# EAGLE schematic circuit_R2 (EAGLE 7.6.0)
REV: 1
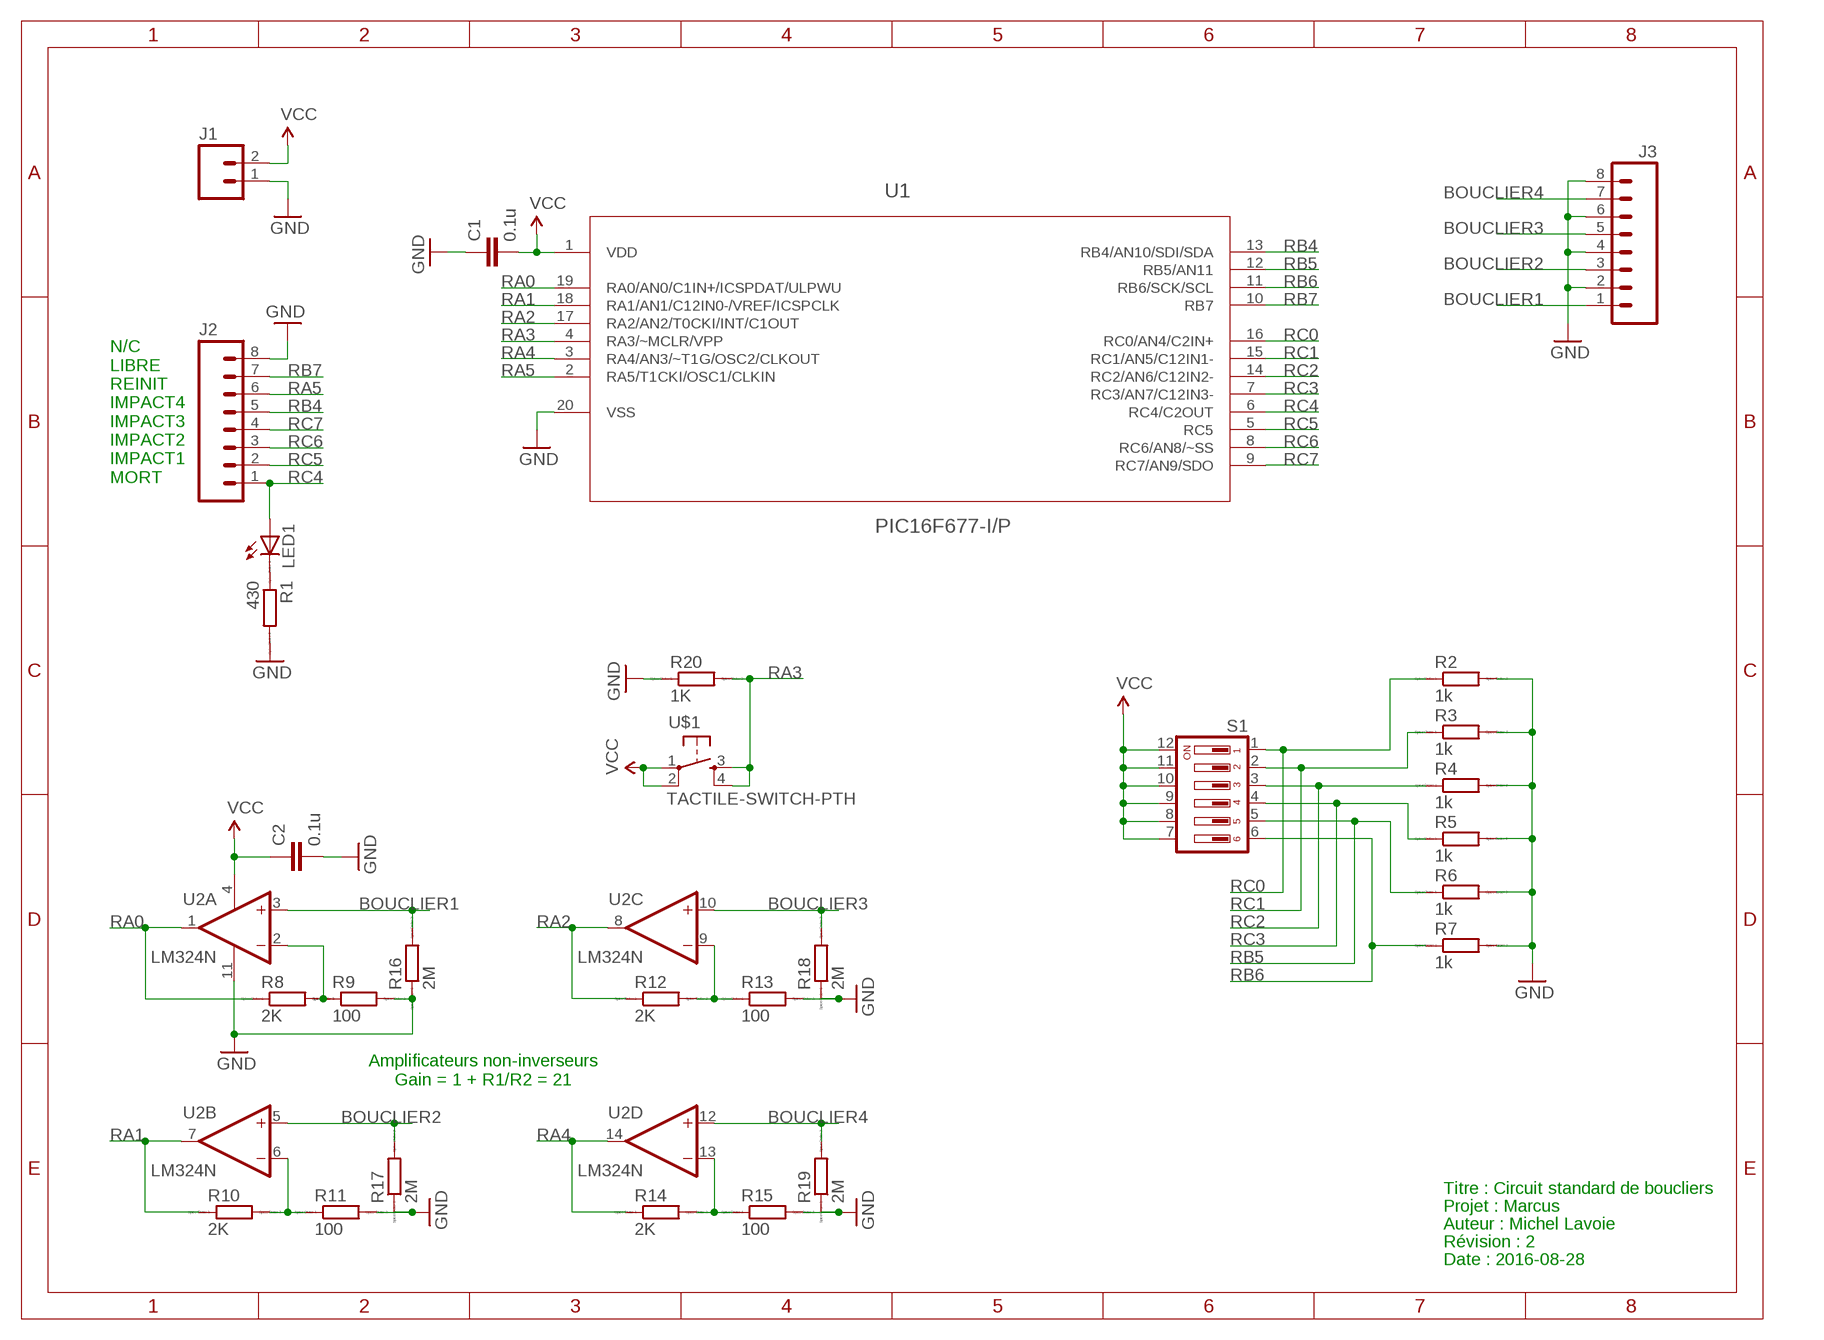
[diagram p0: schematic, sheet 1]

## Parts
C1  0.1u  CAPPTH  [CAP-PTH-SMALL]
C2  0.1u  CAPPTH  [CAP-PTH-SMALL]
J1  M02PTH  [1X02]
J2  M08NO_SILK  [1X08_PIN1_NO_SILK]
J3  M08NO_SILK  [1X08_PIN1_NO_SILK]
LED1  LED3MM  [LED3MM]
R1  430  R0207/10  [0207/10]
R2  1k  R0207/10  [0207/10]
R3  1k  R0207/10  [0207/10]
R4  1k  R0207/10  [0207/10]
R5  1k  R0207/10  [0207/10]
R6  1k  R0207/10  [0207/10]
R7  1k  R0207/10  [0207/10]
R8  2K  R0207/10  [0207/10]
R9  100  R0207/10  [0207/10]
R10  2K  R0207/10  [0207/10]
R11  100  R0207/10  [0207/10]
R12  2K  R0207/10  [0207/10]
R13  100  R0207/10  [0207/10]
R14  2K  R0207/10  [0207/10]
R15  100  R0207/10  [0207/10]
R16  2M  R0207/10  [0207/10]
R17  2M  R0207/10  [0207/10]
R18  2M  R0207/10  [0207/10]
R19  2M  R0207/10  [0207/10]
R20  1K  R0207/10  [0207/10]
S1  DIP06YL  [DIP06YL]
U1  PIC16F677-I/P  [DIP254P762X533-20]
U2  LM324N  [DIL14]
U$1  TACTILE-SWITCH-PTH  [TAC-SWITCH-PTH]

## Nets
5V: C1.2 C2.1 J1.2 S1.7 S1.8 S1.9 S1.10 S1.11 S1.12 U1.1(VDD) U2.4(P:V+) U$1.1 U$1.2 ; supply symbol labelled VCC
BOUCLIER1: J3.1 R16.2 U2.3(A:+IN)
BOUCLIER2: J3.3 R17.2 U2.5(B:+IN)
BOUCLIER3: J3.5 R18.2 U2.10(C:+IN)
BOUCLIER4: J3.7 R19.2 U2.12(D:+IN)
GND: C1.1 C2.2 J1.1 J2.8 J3.2 J3.4 J3.6 J3.8 R1.2 R2.2 R3.2 R4.2 R5.2 R6.2 R7.2 R9.2 R11.2 R13.2 R15.2 R16.1 R17.1 R18.1 R19.1 R20.1 U1.20(VSS) U2.11(P:V-)
N$1: R10.2 R11.1 U2.6(B:-IN)
N$2: LED1.K(C) R1.1
N$3: R8.2 R9.1 U2.2(A:-IN)
N$5: R12.2 R13.1 U2.9(C:-IN)
N$6: R14.2 R15.1 U2.13(D:-IN)
RA0: R8.1 U1.19(RA0/AN0/C1IN+/ICSPDAT/ULPWU) U2.1(A:OUT)
RA1: R10.1 U1.18(RA1/AN1/C12IN0-/VREF/ICSPCLK) U2.7(B:OUT)
RA2: R12.1 U1.17(RA2/AN2/T0CKI/INT/C1OUT) U2.8(C:OUT)
RA3: R20.2 U1.4(RA3/~MCLR/VPP) U$1.3 U$1.4
RA4: R14.1 U1.3(RA4/AN3/~T1G/OSC2/CLKOUT) U2.14(D:OUT)
RA5: J2.6 U1.2(RA5/T1CKI/OSC1/CLKIN)
RB4: J2.5 U1.13(RB4/AN10/SDI/SDA)
RB5: R6.1 S1.5 U1.12(RB5/AN11)
RB6: R7.1 S1.6 U1.11(RB6/SCK/SCL)
RB7: J2.7 U1.10(RB7)
RC0: R2.1 S1.1 U1.16(RC0/AN4/C2IN+)
RC1: R3.1 S1.2 U1.15(RC1/AN5/C12IN1-)
RC2: R4.1 S1.3 U1.14(RC2/AN6/C12IN2-)
RC3: R5.1 S1.4 U1.7(RC3/AN7/C12IN3-)
RC4: J2.1 LED1.A U1.6(RC4/C2OUT)
RC5: J2.2 U1.5(RC5)
RC6: J2.3 U1.8(RC6/AN8/~SS)
RC7: J2.4 U1.9(RC7/AN9/SDO)

## Notes on the sheet
- N/C
  LIBRE
  REINIT
  IMPACT4
  IMPACT3
  IMPACT2
  IMPACT1
  MORT
- Amplificateurs non-inverseurs
  Gain = 1 + R1/R2 = 21
- Titre : Circuit standard de boucliers
- Projet : Marcus
- Auteur : Michel Lavoie
- Révision : 2
- Date : 2016-08-28

## Library data of the parts
C1 C2 = SparkFun-Capacitors:CAP: Capacitor Standard 0603 ceramic capacitor, and 0.1" leaded capacitor.
J1 = SparkFun-Connectors:M02: Standard 2-pin 0.1" header. Use with - straight break away headers ( PRT-00116) - right angle break away headers (PRT-00553) - swiss pins (PRT-00743) - machine pins (PRT-00117) - female headers (PRT-00115) Molex polarized connector foot print use with: PRT-08233 with associated crimp pins and housings. 2.54_SCREWTERM for use with PRT-10571. 3.5mm Screw Terminal footprints for PRT-08084 5mm Screw Terminal footprints for use with PRT-08432
J2 J3 = SparkFun-Connectors:M08: Header 8 Standard 8-pin 0.1" header. Use with straight break away headers (SKU : PRT-00116), right angle break away headers (PRT-00553), swiss pins (PRT-00743), machine pins (PRT-00117), and female headers (PRT-00115).
LED1 = adafruit:LED: LED OSRAM: - CHIPLED LG R971, LG N971, LY N971, LG Q971, LY Q971, LO R971, LY R971 LH N974, LH R974 LS Q976, LO Q976, LY Q976 LO Q996 - Hyper CHIPLED LW Q18S LB Q993, LB Q99A, LB R99A - SideLED LS A670, LO A670, LY A670, LG A670, LP A670 LB A673, LV A673, LT A673, LW A673 LH A674 LY A675 LS A676, LA A676, LO A676, LY A676, LW A676 LS A679, LY A679, LG A679 - Hyper Micro SIDELED® LS Y876, LA Y876, LO Y876, LY Y876 LT Y87S - SmartLED LW L88C, LW L88S LB L89C, LB L89S, LG L890 LS L89K, LO L89K, LY L89K LS L896, LA L896, LO L896, LY L896 - TOPLED LS T670, LO T670, LY T670, LG T670, LP T670 LSG T670, LSP T670, LSY T670, LOP T670, LYG T670 LG T671, LOG T671, LSG T671 LB T673, LV T673, LT T673, LW T673 LH T674 LS T676, LA T676, LO T676, LY T676, LB T676, LH T676, LSB T676, LW T676 LB T67C, LV T67C, LT T67C, LS T67K, LO T67K, LY T67K, LW E67C LS E67B, LA E67B, LO E67B, LY E67B, LB E67C, LV E67C, LT E67C LW T67C LS T679, LY T679, LG T679 LS T770, LO T770, LY T770, LG T770, LP T770 LB T773, LV T773, LT T773, LW T773 LH T774 LS E675, LA E675, LY E675, LS T675 LS T776, LA T776, LO T776, LY T776, LB T776 LHGB T686 LT T68C, LB T68C - Hyper Mini TOPLED® LB M676 - Mini TOPLED Santana® LG M470 LS M47K, LO M47K, LY M47K Source: http://www.osram.convergy.de/
R1-R20 = eagle-ltspice:R: RESISTOR, European symbol; SPICEMODEL: NONE; SPICEPREFIX: R
S1 = switch-dil:DIP06YL: DIL/CODE SWITCH; OC_FARNELL: unknown; OC_NEWARK: unknown
U1 = Microchip_By_element14_Batch_1:PIC16F677-I/P: 8 Bit CMOS Microcontrollers; MPN: PIC16F677-I/P; OC_FARNELL: 1332206; OC_NEWARK: 56J7509; PACKAGE: PDIP-20; SUPPLIER: Microchip
U2 = linear:LM324: OP AMP
U$1 = GeekAmmo:TACTILE-SWITCH: Tactile Switch 4 Pins, SPST NO

## Net classes
0 default: width 0.254 mm, clearance 0.305 mm